# Altium schematic sheet RF_AMP.SchDoc: RF_AMP
size A4; DocumentNumber: 17; Revision: 2.0; SheetNumber: 17; SheetTotal: 18
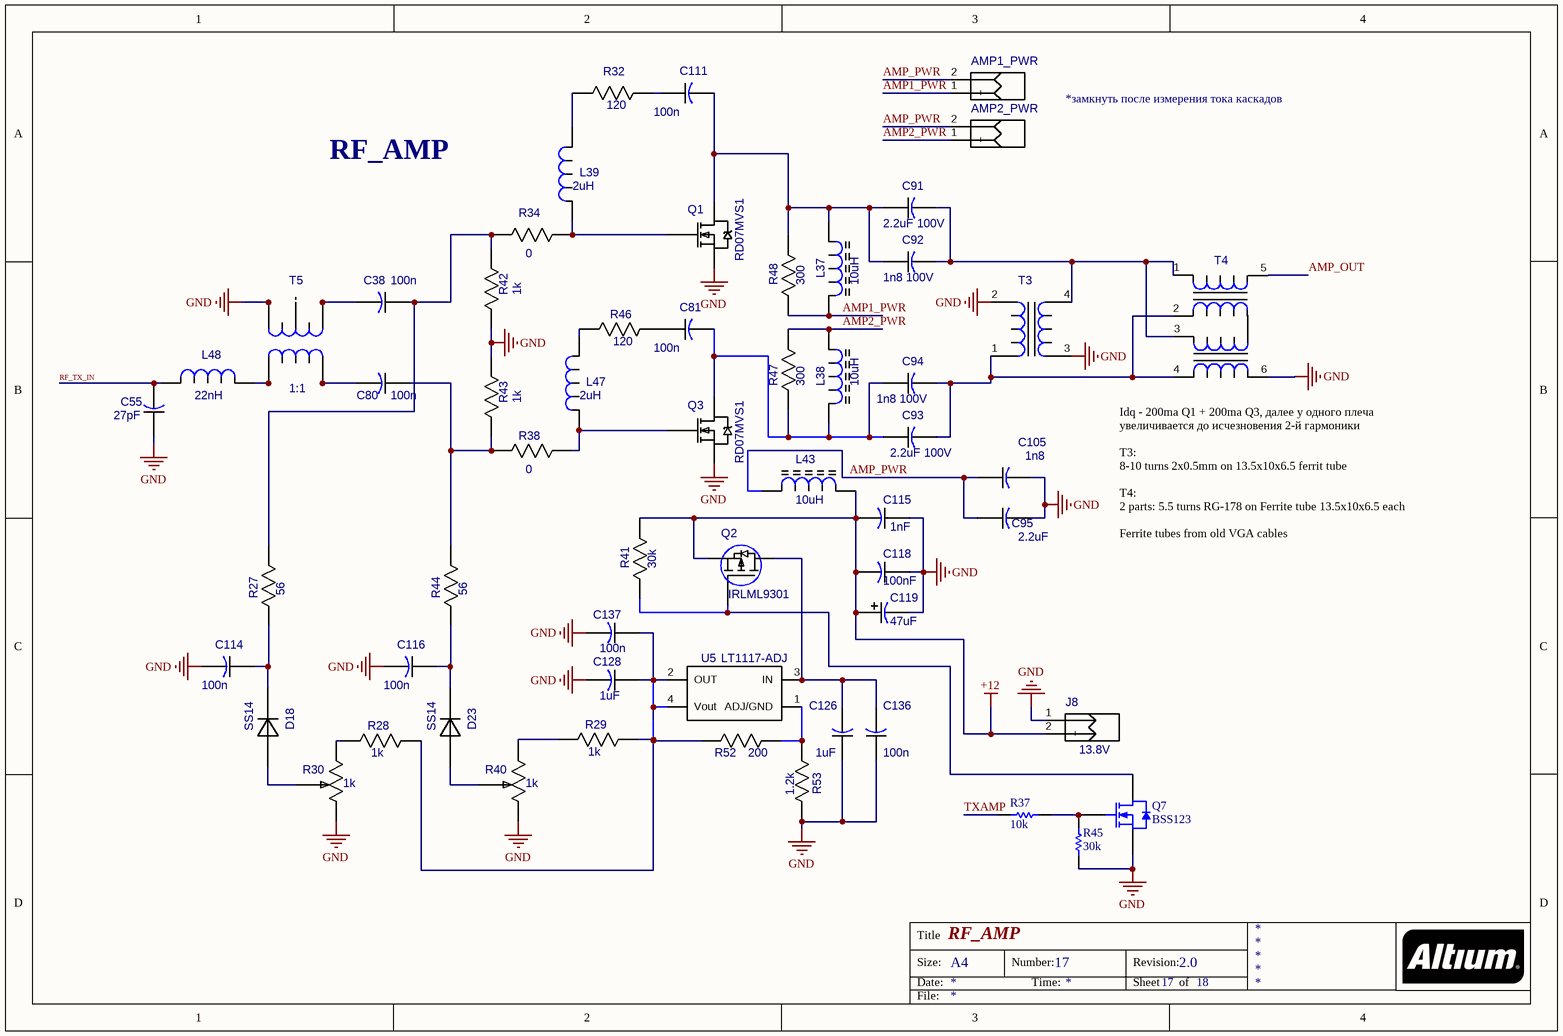
[diagram p0: RF_AMP.SchDoc]

## Parts
AMP1_PWR  51022-0200  [51022-0200]  (value not drawn)
AMP2_PWR  51022-0200  [51022-0200]  (value not drawn)
C38  100n  [CAP_0805]
C55  27pF  [CAP_0805]
C80  100n  [CAP_0805]
C81  100n  [CAP_1206]
C91  2.2uF 100V  [CAP_1206]
C92  1n8 100V  [CAP_1206]
C93  2.2uF 100V  [CAP_1206]
C94  1n8 100V  [CAP_1206]
C95  2.2uF  [CAP_1206]
C105  1n8  [CAP_1206]
C111  100n  [CAP_1206]
C114  100n  [CAP_0805]
C115  1nF  [CAP_0805]
C116  100n  [CAP_0805]
C118  100nF  [CAP_0805]
C119  47uF  [CAPAE_6.6x6.6h5.4]
C126  1uF  [CAP_0805]
C128  1uF  [CAP_0805]
C136  100n  [CAP_0805]
C137  100n  [CAP_0805]
D18  SS14  [SS14]
D23  SS14  [SS14]
J8  value 13.8V  [1986717-2]  (hidden comment: JX2)
L37  10uH  [IND_FERRITE_CORE]
L38  10uH  [IND_FERRITE_CORE]
L39  2uH  [IND_0805]
L43  10uH  [IND_FERRITE_CORE]
L47  2uH  [IND_0805]
L48  22nH  [IND_0805]
Q1  RD07MVS1  [RD07MVS1]
Q2  IRLML9301  [SOT23]
Q3  RD07MVS1  [RD07MVS1]
Q7  BSS123  [FAIR-SOT23-3_V]
R27  56  [RES_0805]
R28  1k  [RES_0805]
R29  1k  [RES_0805]
R30  value 1k  [306J]  (hidden comment: ADJ-1k)
R32  120  [RES_0805]
R34  0  [RES_1206]
R37  10k  [RESC2013X60X40NL20T25]
R38  0  [RES_1206]
R40  value 1k  [306J]  (hidden comment: ADJ-1k)
R41  30k  [RES_0805]
R42  1k  [RES_0805]
R43  1k  [RES_0805]
R44  56  [RES_0805]
R45  30k  [RESC2013X60X40NL20T25]
R46  120  [RES_0805]
R47  300  [RES_1206]
R48  300  [RES_1206]
R52  200  [RES_0805]
R53  1.2k  [RES_0805]
T3  8T M2000HM 10*6*5  [Rutrof]  (value not drawn)
T4  TRANSF_OUT  [TRANSF_OUT]  (value not drawn)
T5  1:1  [TRANSF_ACORE2]
U5  value LT1117-ADJ  [LT1117IST-ADJ]  (hidden comment: LT1117IST-ADJ)

## Nets
+12: C115.2 C118.2 C119.1(PLUS) J8.2(+) L43.2(B) Q2.2(S) R41.2
GND: C55.1 C95.2 C105.2 C114.2 C115.1 C116.2 C118.1 C119.2(MINUS) C126.1 C128.2 C136.1 C137.2 J8.1(-) Q1.2(S) Q3.2(S) Q7.2(S) R30.1(CCW) R40.1(CCW) R42.1 R43.2 R45.1 R53.2 T3.2(P2) T3.3(S1) T4.6(OUT2) T5.3(S3) T5.9
AMP1_PWR: AMP1_PWR.1(+) L37.2(B) R48.1
AMP2_PWR: AMP2_PWR.1(+) L38.1(A) R47.2
AMP_OUT: T4.5(OUT1)
AMP_PWR: AMP1_PWR.2(-) AMP2_PWR.2(-) C95.1 C105.1 L43.1(A)
RF_TX_IN: C55.2 L48.1
TXAMP: R37.2
NetC38_1: C38.1 R27.2 R34.1 R42.2
NetC38_2: C38.2 T5.1(S1) T5.7
NetC80_1: C80.1 R38.1 R43.1 R44.2
NetC80_2: C80.2 T5.6(P1) T5.10
NetC81_1: C81.1 R46.2
NetC81_2: C81.2 C93.1 C94.1 L38.2(B) Q3.1(D) R47.1
NetC91_1: C91.1 C92.1 C111.2 L37.1(A) Q1.1(D) R48.2
NetC91_2: C91.2 C92.2 T3.4(S2) T4.1(T1P) T4.3(T2N)
NetC93_2: C93.2 C94.2 T3.1(P1) T4.2(T1N) T4.4(T2P)
NetC111_1: C111.1 R32.2
NetC114_1: C114.1 D18.1(K) R27.1
NetC116_1: C116.1 D23.1(K) R44.1
NetC126_2: C126.2 C136.2 Q2.3(D) U5.3(IN)
NetC128_1: C128.1 C137.1 R28.2 R29.2 R52.1 U5.2(OUT) U5.4(Vout)
NetD18_2: D18.2(A) R30.2(W)
NetD23_2: D23.2(A) R40.2(W)
NetL39_1: L39.1 Q1.3(G) R34.2
NetL39_2: L39.2 R32.1
NetL47_1: L47.1 Q3.3(G) R38.2
NetL47_2: L47.2 R46.1
NetL48_2: L48.2 T5.4(P2) T5.11
NetQ2_1: Q2.1(G) Q7.3(D) R41.1
NetQ7_1: Q7.1(G) R37.1 R45.2
NetR28_1: R28.1 R30.3(CW)
NetR29_1: R29.1 R40.3(CW)
NetR52_2: R52.2 R53.1 U5.1(ADJ/GND)

Not connected (* = marked no-connect by the designer): T5 2(S2) 8(S2)

## Notes on the sheet
- *замкнуть после измерения тока каскадов
- RF_AMP
- (near T4) Idq - 200ma Q1 + 200ma Q3, далее у одного плеча увеличивается до исчезновения 2-й гармоники
  T3:
  8-10 turns 2x0.5mm on 13.5х10х6.5 ferrit tube
  T4:
  2 parts: 5.5 turns RG-178 on Ferrite tube 13.5х10x6.5 each
  Ferrite tubes from old VGA cables
- Title
- Size:
- Date:
- A4
- Number:
- Time:
- Revision:
- Sheet
- of
- File:

## Library data of the parts
C38 C55 C80 C114-C116 C118 C126 C128 C136 C137 = CAP_0805
  C114 C116 C136 C137: Value: 100n
  C115: Value: 1nF
  C118: Value: 100nF
  C126 C128: Value: 1uF
C81 C91-C95 C105 C111 = CAP_1206
  C91 C93: Value: 2.2uF 100V
  C92 C94: Value: 1n8 100V
C119 = CAPAE_6.6x6.6h5.4: Value: 47uF
J8 = 1986717-2
L37 L38 L43 = IND_FERRITE_CORE: Inductor; Value: 10uH
L39 L47 L48 = IND_0805
Q2 = MOSFET_ENH_PD: MOSFET; Value: IRLML9301
Q7 = CMP-2000-04934-1: N-Channel Logic Level Enhancement Mode Field Effect Transistor, 1.7 V, -55 to 150 degC, 3-Pin SOT-23, RoHS, Tape and Reel; Manufacturer: Fairchild; Channel Type: N; Typical Turn-Off Delay Time: 17ns; Maximum Continuous Drain Current: 0.17A; Rad Hard: No; Typical Rise Time: 9ns; Typical Fall Time: 2.4ns; Maximum Gate Source Voltage: ±20V; Maximum Drain Source Voltage: 100V; Typical Turn-On Delay Time: 1.7ns; RDS-on: 6000@10VmOhm; Package Version: Rev. 12, 03/2016; Packaging: Tape&Reel; Package Reference: SOT23-3; Channel Mode: Enhancement; Operating Temperature: -55to150degC; Package Description: 3-Pin Small Outline Transistor, Body 2.92 x 1.325 mm, Pitch 0.95 mm; Category: MOSFET; Datasheet Version: Jun-03; Datasheet URL: https://www.fairchildsemi.com/datasheets/BS/BSS123.pdf; Manufacturer URL: https://www.fairchildsemi.com/; Mounting: SurfaceMount; Package: 3SOT-23; Package URL: http://www.fairchildsemi.com/dwg/MA/MA03D.pdf
R27-R29 R32 R41-R44 R46 R52 R53 = RES_0805
  R27 R44: Value: 56
  R28 R29 R42 R43: Value: 1k
  R41: Value: 30k
  R52: Value: 200
  R53: Value: 1.2k
R30 R40 = 306J
R34 R38 R47 R48 = RES_1206
  R47 R48: Value: 300
R37 R45 = CMP-2001-00626-1: RES_0805; Manufacturer: Panasonic; Part Number: ERA-6AEB303V
T3 = TRANSF_ICORE: Transformer
T4 = TRANSF_OUT_2: Value: *
T5 = TRANSF_ACORE2: Value: 1:1
D18 D23 = SS14: Value: SS14
Q1 Q3 = RD07MVS1: Value: RD07MVS1